# EAGLE design buslamp (EAGLE 5.11)
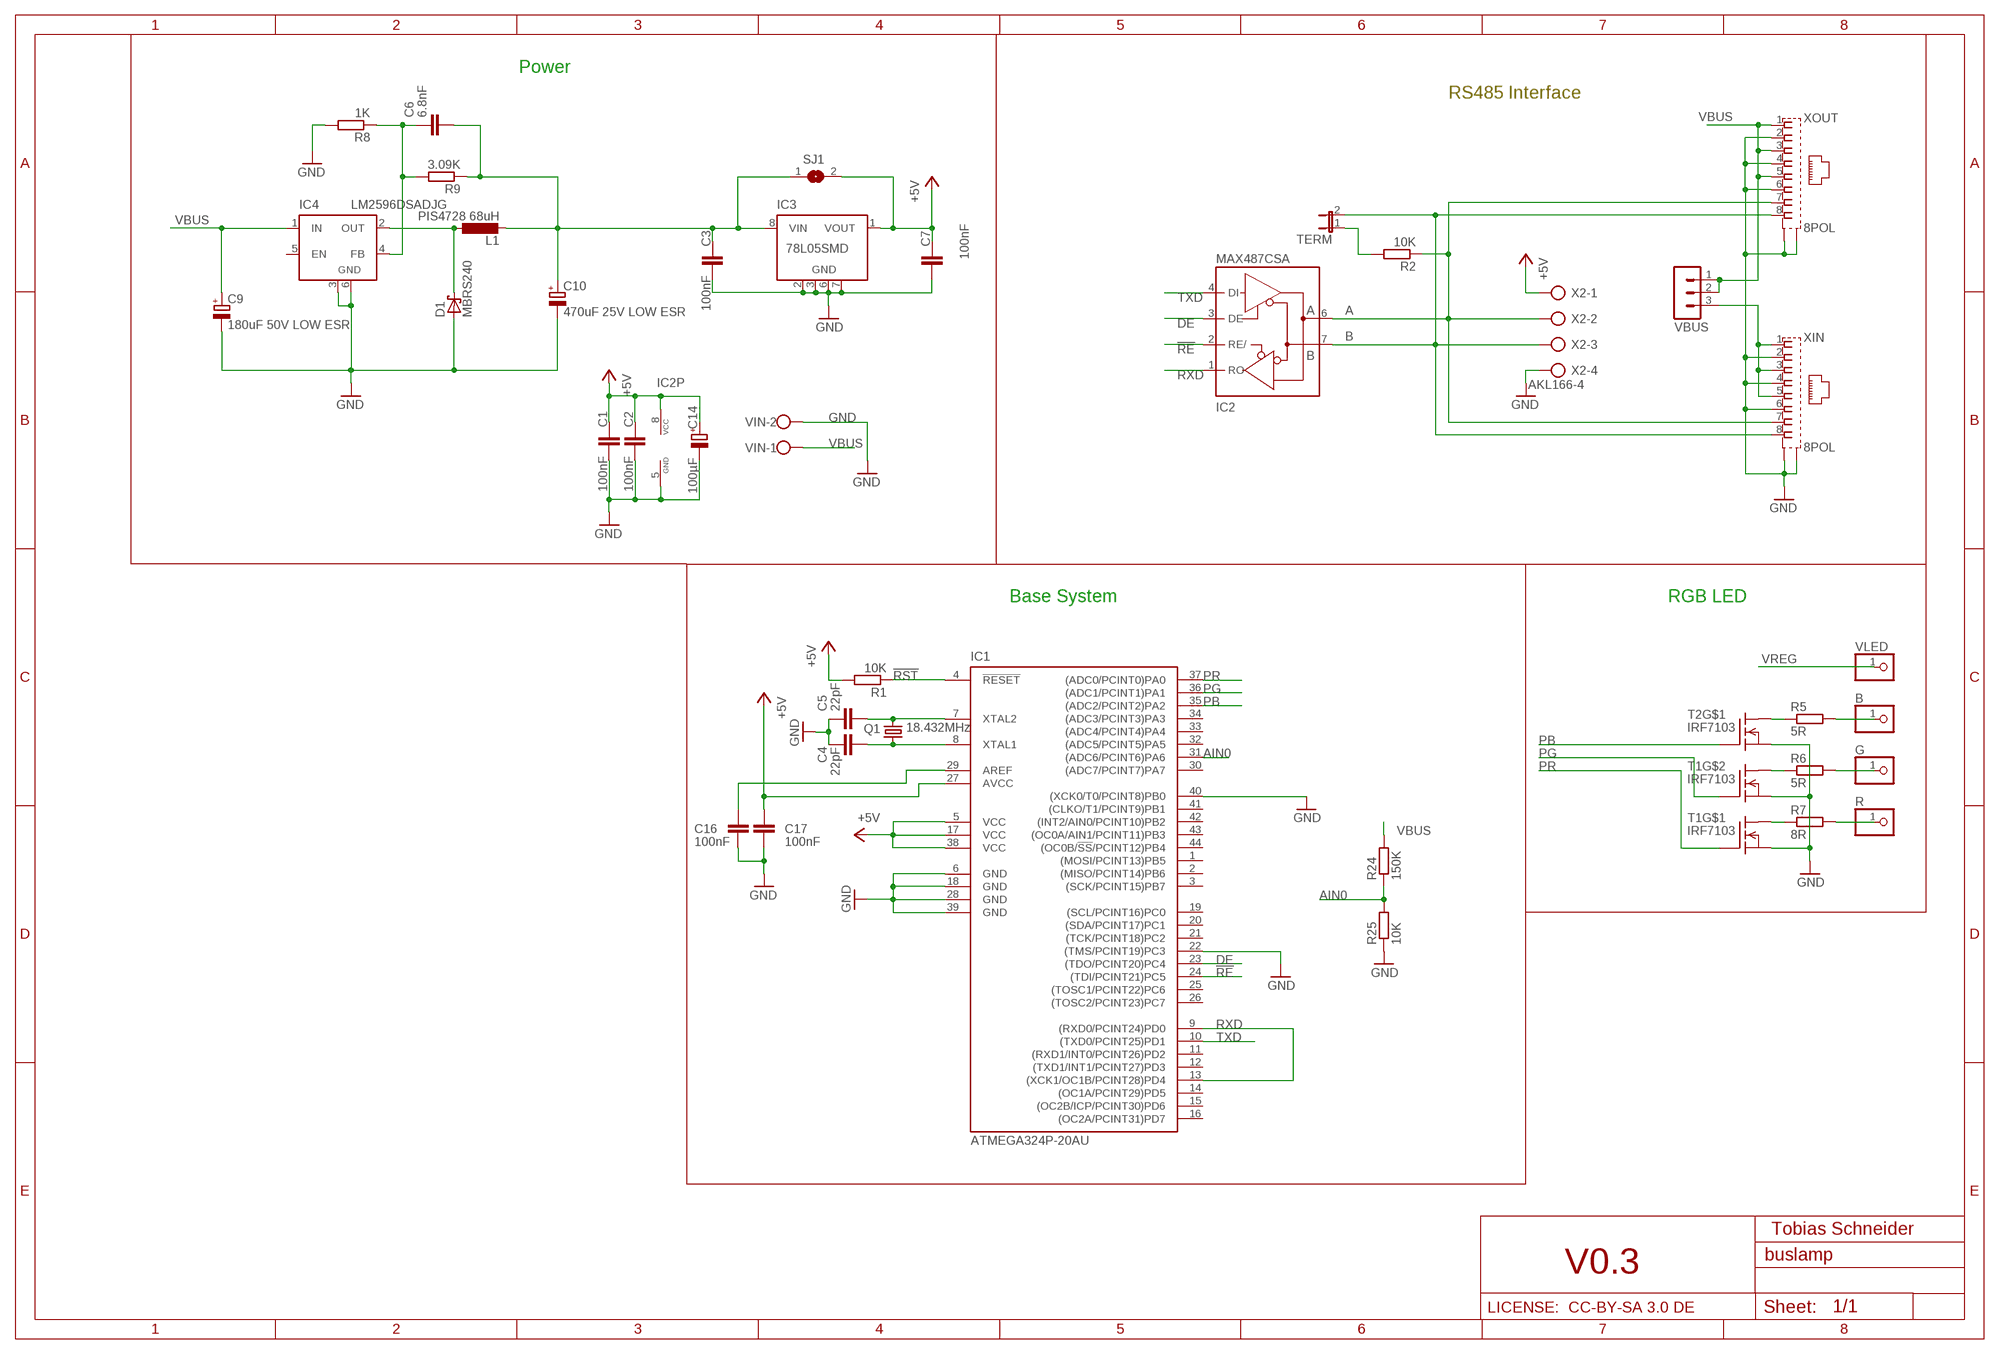
[diagram p0: schematic, sheet 1]

## Parts
B  PINHD-1X1  [1X01]
C1  100nF  C-EUC0805K  [C0805K]
C2  100nF  C-EUC0805K  [C0805K]
C3  100nF  C-EUC0805K  [C0805K]
C4  22pF  C-EUC0805K  [C0805K]
C5  22pF  C-EUC0805K  [C0805K]
C6  6.8nF  C-EUC0805K  [C0805K]
C7  100nF  C-EUC0805K  [C0805K]
C9  180uF 50V LOW ESR  CPOL-EUE3.5-8  [E3,5-8]
C10  470uF 25V LOW ESR  CPOL-EUE2.5-5  [E2,5-5]
C14  100µF  CPOL-EUE2.5-6  [E2,5-6]
C16  100nF  C-EUC0805  [C0805]
C17  100nF  C-EUC0805  [C0805]
D1  MBRS240  MBRS130LT3  [SMB]
G  PINHD-1X1  [1X01]
IC1  ATMEGA324P-20AU  MEGA164P/324P/644P-AU  [TQFP44]
IC2  MAX487CSA  MAX481CSA  [SO08]
IC3  78L05SMD  [SO08]
IC4  LM2596DSADJG  LM2596S  [TO263-5]
L1  PIS4728 68uH  PSI4728  [PIS4728]
Q1  18.432MHz  CRYTALHC49S  [HC49/S]
R  PINHD-1X1  [1X01]
R1  10K  R-EU_M0805  [M0805]
R2  10K  R-EU_M1206  [M1206]
R5  5R  R-EU_0414/15  [0414/15]
R6  5R  R-EU_0414/15  [0414/15]
R7  8R  R-EU_0414/15  [0414/15]
R8  1K  R-EU_M0805  [M0805]
R9  3.09K  R-EU_M0805  [M0805]
R24  150K  R-EU_R0805  [R0805]
R25  10K  R-EU_R0805  [R0805]
SJ1  SJ  [SJ]
T1  IRF7103  [SO-8]
T2  IRF7103  [SO-8]
TERM  JP1E  [JP1]
VBUS  MA03-1  [MA03-1]
VIN  W237-102-350  [W237-102-3.5-1.2]
VLED  PINHD-1X1  [1X01]
X2  AKL166-4  RIACON-4  [RIACON-4]
XIN  8POL  [8POL]
XOUT  8POL  [8POL]

## Nets
!RE: IC1.24((TDI/PCINT21)PC5) IC2.2(RE/)
!RST: IC1.4(!RESET) R1.1
+5V: C1.1 C2.1 C7.1 C14.+ C17.2 IC1.5(VCC) IC1.17(VCC) IC1.27(AVCC) IC1.38(VCC) IC2.8(VCC) IC3.1(VOUT) R1.2 SJ1.2 X2.1
A: IC2.6(A) R2.1 X2.2 XIN.7 XOUT.7
AIN0: IC1.31((ADC6/PCINT6)PA6) R24.1 R25.2
B: IC2.7(B) TERM.2 X2.3 XIN.8 XOUT.8
DE: IC1.23((TDO/PCINT20)PC4) IC2.3(DE)
GND: C1.2 C2.2 C3.2 C4.1 C5.1 C7.2 C9.- C10.- C14.- C16.1 C17.1 D1.A IC1.6(GND) IC1.18(GND) IC1.22((TMS/PCINT19)PC3) IC1.28(GND) IC1.39(GND) IC1.40((XCK0/T0/PCINT8)PB0) IC2.5(GND) IC3.2(GND) IC3.3(GND) IC3.6(GND) IC3.7(GND) IC4.3(GND) IC4.6(GND) R8.2 R25.1 T1.1(S) T1.3(S) T2.1(S) VIN.2 X2.4 XIN.2 XIN.4 XIN.6 XIN.S1 XIN.S2 XOUT.2 XOUT.4 XOUT.6 XOUT.S1 XOUT.S2
N$1: R7.1 T1.8(D1)
N$3: C6.1 IC4.4(FB) R8.1 R9.2
N$4: R6.1 T1.5(D1)
N$5: R5.1 T2.8(D1)
N$6: R2.2 TERM.1
N$7: R7.2 R.1
N$8: G.1 R6.2
N$9: B.1 R5.2
N$10: D1.C IC4.2(OUT) L1.1
N$29: C16.2 IC1.29(AREF)
PB: IC1.35((ADC2/PCINT2)PA2) T2.2(G)
PG: IC1.36((ADC1/PCINT1)PA1) T1.4(G)
PR: IC1.37((ADC0/PCINT0)PA0) T1.2(G)
RXD: IC1.9((RXD0/PCINT24)PD0) IC1.13((XCK1/OC1B/PCINT28)PD4) IC2.1(RO)
TXD: IC1.10((TXD0/PCINT25)PD1) IC2.4(DI)
VBUS: C9.+ IC4.1(IN) R24.2 VBUS.1 VBUS.2 VIN.1 XOUT.1 XOUT.3 XOUT.5
VBUSOUT: VBUS.3 XIN.1 XIN.3 XIN.5
VREG: C3.1 C6.2 C10.+ IC3.8(VIN) L1.2 R9.1 SJ1.1 VLED.1
XTAL1: C5.2 IC1.7(XTAL2) Q1.2
XTAL2: C4.2 IC1.8(XTAL1) Q1.1
Unconnected: IC1.1((MOSI/PCINT13)PB5) IC1.2((MISO/PCINT14)PB6) IC1.3((SCK/PCINT15)PB7) IC1.11((RXD1/INT0/PCINT26)PD2) IC1.12((TXD1/INT1/PCINT27)PD3) IC1.14((OC1A/PCINT29)PD5) IC1.15((OC2B/ICP/PCINT30)PD6) IC1.16((OC2A/PCINT31)PD7) IC1.19((SCL/PCINT16)PC0) IC1.20((SDA/PCINT17)PC1) IC1.21((TCK/PCINT18)PC2) IC1.25((TOSC1/PCINT22)PC6) IC1.26((TOSC2/PCINT23)PC7) IC1.30((ADC7/PCINT7)PA7) IC1.32((ADC5/PCINT5)PA5) IC1.33((ADC4/PCINT4)PA4) IC1.34((ADC3/PCINT3)PA3) IC1.41((CLKO/T1/PCINT9)PB1) IC1.42((INT2/AIN0/PCINT10)PB2) IC1.43((OC0A/AIN1/PCINT11)PB3) IC1.44((OC0B/!SS!/PCINT12)PB4) IC3.4(NC) IC3.5(NC) IC4.5(EN) T1.6(D) T1.7(D) T2.3(S) T2.4(G) T2.5(D1) T2.6(D) T2.7(D)

## Notes on the sheet
- Power
- RS485 Interface
- Base System | RGB LED
- Tobias Schneider
- V0.3
- LICENSE:  CC-BY-SA 3.0 DE

## Library data of the parts
B G R VLED = pinhead:PINHD-1X1: PIN HEADER
C1-C7 C16 C17 = rcl:C-EU: CAPACITOR, European symbol
C9 C10 C14 = rcl:CPOL-EU: POLARIZED CAPACITOR, European symbol
D1 = diode:MBRS130LT3: Schottky Power Rectifier Source: http://www.onsemi.com/pub/Collateral/MBRS130LT3-D.PDF
IC1 = avr-5:MEGA164P/324P/644P-AU
IC2 = maxim:MAX481CSA: RS485 TRANSEIVER
IC3 = linear:78L*SMD: Positive VOLTAGE REGULATOR
IC4 = linear:LM2596S: STEP-DOWN VOLTAGE REGULATOR
L1 = rcl:PSI4728
Q1 = crystal:CRYTAL: CRYSTAL
R1 R2 R8 R9 R24 R25 = rcl:R-EU_: RESISTOR, European symbol
R5-R7 = rclml:R-EU_: RESISTOR, European symbol
SJ1 = jumper:SJ: SMD solder JUMPER
T1 T2 = transistor-fet+irf7201:IRF7103
TERM = jumper:JP1E: JUMPER
VBUS = con-lstb:MA03-1: PIN HEADER
VIN = clamps:W237-102: WAGO SCREW CLAMP
X2 = con-riacon:RIACON-4
XIN XOUT = con-amp:8POL

## Board
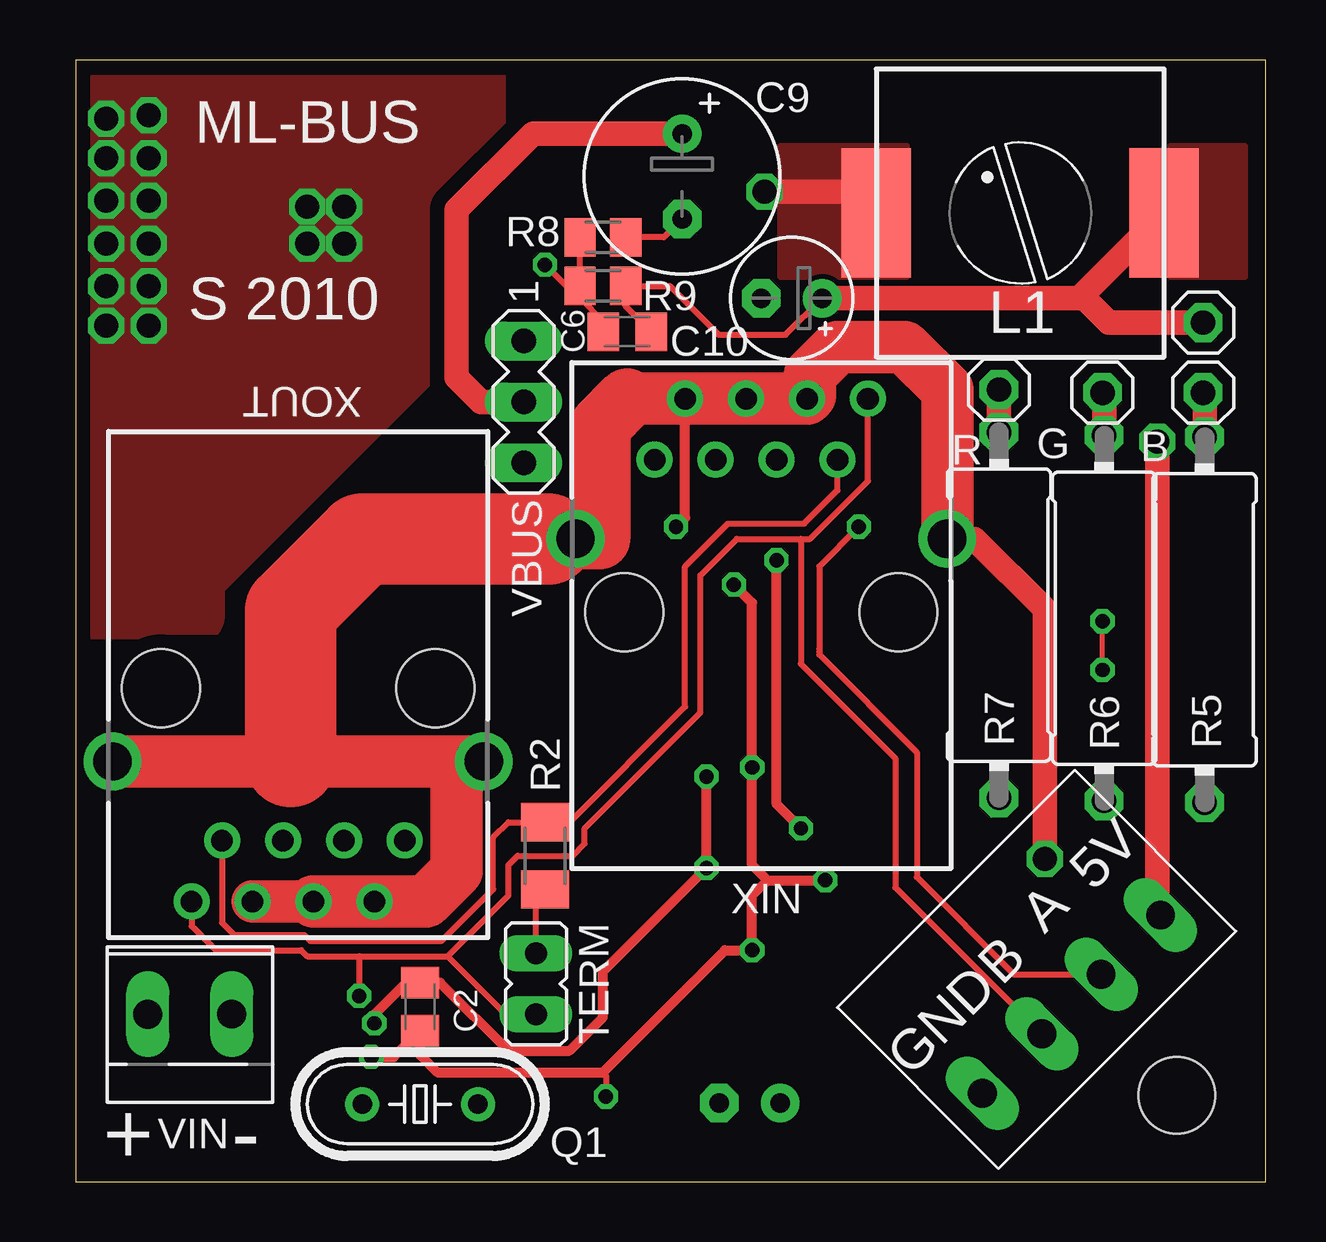
[diagram p1: board, top side]
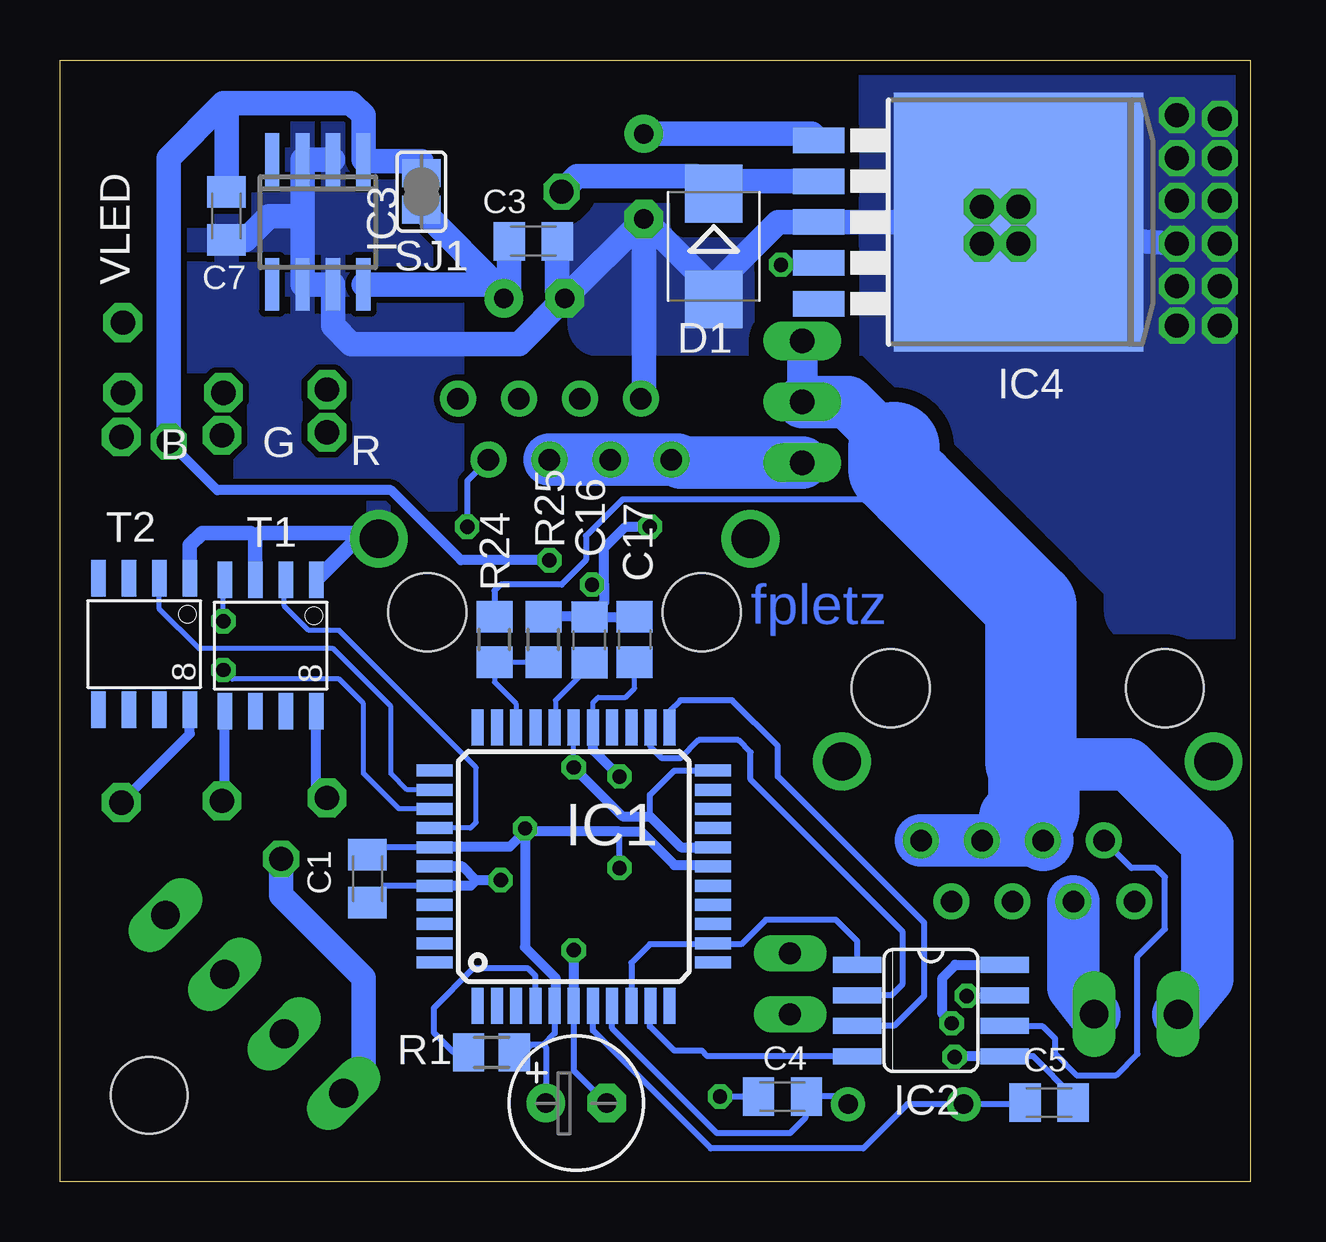
[diagram p2: board, bottom side, seen from below]

Size 49.61 x 46.76 mm. Coordinates in mm from the lower left corner, seen from the top.
Outline: 0,0 49.61,0 49.61,46.76 0,46.76 0,0
Copper layers (1*16): Top 0.035mm / dielectric 1.5mm / Bottom 0.035mm
Design rules "default *": minimum track width 0.2mm, minimum drill 0.5mm, track to track 0.2mm, track to pad 0.2mm, pad to pad 0.2mm, via to via 0.2mm, smd to smd 0mil, copper to edge 0.2mm, drill to drill 8mil, minimum pad ring 0.3mm, minimum via ring 8mil, stop-mask expansion 4mil, vias tented up to drill 0mil, thermal gap 10mil
Holes 3.2 mm at 45.89,3.61
tRestrict: area 23.7,21 to 23.7,22.4

### Footprints (pad centres in the part's own frame; a part is rotated, then mirrored left to right if it is on the bottom)
1X01 = drill 1.016 octagon: 1 0,0
C0805K = smd 1.3 x 1.6: 1 -1,0; 2 1,0
E3,5-8 = drill 0.813 pad 1.6 round: + -1.778,0 | drill 0.813 pad 1.6 octagon: - 1.778,0
E2,5-5 = drill 0.813 pad 1.6 round: + -1.27,0 | drill 0.813 pad 1.6 octagon: - 1.27,0
E2,5-6 = drill 0.813 pad 1.6 round: + -1.27,0 | drill 0.813 pad 1.6 octagon: - 1.27,0
C0805 = smd 1.3 x 1.5: 1 -0.95,0; 2 0.95,0
SMB = smd 2.4 x 2.4: A 2.2,0; C -2.2,0
TQFP44 = smd 1.5 x 0.5: 1 -5.8,4; 2 -5.8,3.2; 3 -5.8,2.4; 4 -5.8,1.6; 5 -5.8,0.8; 6 -5.8,0; 7 -5.8,-0.8; 8 -5.8,-1.6; 9 -5.8,-2.4; 10 -5.8,-3.2; 11 -5.8,-4; 23 5.8,-4; 24 5.8,-3.2; 25 5.8,-2.4; 26 5.8,-1.6; 27 5.8,-0.8; 28 5.8,0; 29 5.8,0.8; 30 5.8,1.6; 31 5.8,2.4; 32 5.8,3.2; 33 5.8,4 | smd 0.5 x 1.5: 12 -4,-5.8; 13 -3.2,-5.8; 14 -2.4,-5.8; 15 -1.6,-5.8; 16 -0.8,-5.8; 17 0,-5.8; 18 0.8,-5.8; 19 1.6,-5.8; 20 2.4,-5.8; 21 3.2,-5.8; 22 4,-5.8; 34 4,5.8; 35 3.2,5.8; 36 2.4,5.8; 37 1.6,5.8; 38 0.8,5.8; 39 0,5.8; 40 -0.8,5.8; 41 -1.6,5.8; 42 -2.4,5.8; 43 -3.2,5.8; 44 -4,5.8
SO08 = smd 0.66 x 2.032: 1 -1.905,-3.073; 2 -0.635,-3.073; 3 0.635,-3.073; 4 1.905,-3.073; 5 1.905,3.073; 6 0.635,3.073; 7 -0.635,3.073; 8 -1.905,3.073
SO08' = smd 0.6 x 2.2: 1 -1.905,-2.6; 2 -0.635,-2.6; 3 0.635,-2.6; 4 1.905,-2.6; 5 1.905,2.6; 6 0.635,2.6; 7 -0.635,2.6; 8 -1.905,2.6
TO263-5 = smd 1.067 x 2.159: 1 -3.404,-5.791; 2 -1.702,-5.791; 3 0,-5.791; 4 1.702,-5.791; 5 3.404,-5.791 | smd 10.8 x 10.41: 6 0,2.54
PIS4728 = smd 5.4 x 2.9: 1 0,6; 2 0,-6
HC49/S = drill 0.813 round: 1 -2.413,0; 2 2.413,0
M0805 = smd 1.3 x 1.6: 1 -0.95,0; 2 0.95,0
M1206 = smd 1.6 x 2: 1 -1.4,0; 2 1.4,0
0414/15 = drill 1.016 octagon: 1 -7.62,0; 2 7.62,0
R0805 = smd 1.3 x 1.5: 1 -0.95,0; 2 0.95,0
SJ = smd 1.168 x 1.6: 1 -0.762,0; 2 0.762,0
SO-8 = smd 1.524 x 0.61: 1 -2.743,1.27; 2 -2.743,0; 3 -2.743,-1.27; 4 -2.743,-2.54; 5 2.743,-2.54; 6 2.743,-1.27; 7 2.743,0; 8 2.743,1.27
JP1 = drill 0.914 long: 1 0,-1.27; 2 0,1.27
MA03-1 = drill 1.016 long: 1 -2.54,0; 2 0,0; 3 2.54,0
W237-102-3.5-1.2 = drill 1.2 long: 1 -1.7,0 | drill 1.194 long: 2 1.8,0
RIACON-4 = drill 1.2 long: 1 0,5.25; 2 0,1.75; 3 0,-1.75; 4 0,-5.25
8POL = drill 0.9 round: 1 -4.445,6.35; 2 -3.175,8.89; 3 -1.905,6.35; 4 -0.635,8.89; 5 0.635,6.35; 6 1.905,8.89; 7 3.175,6.35; 8 4.445,8.89 | drill 1.6 round: S1 -7.745,3.05; S2 7.745,3.05 | hole 3.25: -5.715,0; 5.715,0

### Placement (x,y rotation side)
B  46.99,32.89 0 top
C1  36.79,12.64 270 bottom
C2  14.35,7.3 270 top
C3  29.88,39.2 0 bottom
C4  19.49,3.56 0 bottom
C5  8.38,3.3 180 bottom
C6  22.99,35.43 0 top
C7  42.67,40.26 270 bottom
C9  25.27,41.91 270 top
C10  29.84,36.83 180 top
C14  28.09,3.28 0 bottom
C16  27.54,22.59 270 bottom
C17  25.65,22.61 270 bottom
D1  22.35,38.99 270 bottom
G  42.8,32.89 0 top
IC1  28.19,13.14 90 bottom
IC2  13.31,7.14 270 bottom
IC3  78L05SMD  [SO08']  38.86,40.01 180 bottom
IC4  12.19,40.01 270 bottom
L1  39.37,40.39 90 top
Q1  14.35,3.24 180 top
R  38.48,33.02 0 top
R1  31.62,5.4 0 bottom
R2  19.56,13.59 270 top
R5  47.05,23.43 90 top
R6  42.86,23.5 90 top
R7  38.48,23.62 90 top
R8  21.97,39.37 0 top
R9  21.97,37.34 180 top
R24  31.5,22.61 90 bottom
R25  29.46,22.61 270 bottom
SJ1  34.54,41.27 90 bottom
T1  40.2,22.35 270 bottom
T2  45.47,22.42 270 bottom
TERM  19.18,8.26 180 top
VBUS  18.67,32.51 270 top
VIN  4.7,6.99 0 top
VLED  46.99,35.81 0 top
X2  41.5,7.4 315 top
XIN  28.57,23.75 0 top
XOUT  9.27,20.57 180 top

### Tracks (layer width: path | path; a pad name or v marks a point on that pad's centre or on a via)
!RE
  Bottom 0.254: IC2.2 14.96,7.78 14.48,8.26 14.48,10.41 20.83,16.76 20.83,17.91 21.34,18.41 22.99,18.41 23.75,17.65 24.51,17.65 24.99,18.14 IC1.24 25.02,18.92
!RST
  Bottom 0.254: IC1.4 29.79,8.59 30.1,8.89 32.38,8.89 34.04,7.24 34.04,6.22 33.21,5.4 R1.1
+5V  (via drill 0.6, 1 pad 1.02)
  Top 0.254: v12.45,6.6 12.45,6.99 | 13.76,8.3 C2.1 | C2.1 14.4,8.26 | C2.1 15.19,8.3
  Top 0.406: v26.29,16.89 v26.29,13.08 21.97,8.76 21.97,6.86 20.57,5.46 18.03,5.46 15.19,8.3 | v30.23,14.73 29.21,15.75 v29.21,25.91 | 12.45,6.99 13.76,8.3
  Top 1.016: X2.1 45.09,11.25 v45.09,30.86
  Bottom 0.2: IC1.27 27.39,19.98 27.18,20.19 26.04,20.19 25.65,20.57 C17.2
  Bottom 0.254: v12.45,6.6 12.83,6.99 | 30.23,14.61 v30.23,14.73 | 33.97,13.97 IC1.38 36.48,13.94 C1.1 | 22.46,13.21 IC1.17 | 28.96,7.38 IC1.5 28.99,6.18 29.46,5.71 | v26.29,13.08 26.29,14.61 | 29.46,5.71 29.97,5.71 30.29,5.4 R1.2 30.67,5.01 | C14.+ 29.36,5.61 29.46,5.71
  Bottom 0.406: IC2.8 12.29,9.05 12.83,8.51 12.83,6.99 | 30.23,14.61 30.86,13.97 33.97,13.97 | 30.23,14.61 26.29,14.61 25.4,14.61 24,13.21 22.46,13.21 | IC1.27 27.39,18 v26.29,16.89 | 28.96,7.38 28.96,8.51 30.23,9.78 30.23,14.61 | v29.21,25.91 32.89,25.91 35.81,28.83 43.05,28.83 v45.09,30.86
  Bottom 1.016: SJ1.2 34.54,42.55 36.9,42.55 IC3.1 36.96,44.45 37.47,44.96 42.8,44.96 | v45.09,30.86 45.09,42.67 42.8,44.96 | C7.1 42.67,44.83 42.8,44.96
A  (via drill 0.6)
  Top 0.254: XIN.7 31.75,28.83 30.35,27.43 27.18,27.43 25.4,25.65 25.4,19.81 20.58,14.99 R2.1 18.03,14.99 17.4,14.35 17.4,12.19 15.24,10.03 9.78,10.03 9.53,10.29 6.6,10.29 6.1,10.79 XOUT.7 | X2.2 39.11,8.64 35.05,12.7 35.05,17.91 30.99,21.97 30.99,22.23 | 30.99,22.23 30.99,22.1 | 30.99,22.23 30.99,25.65 v32.64,27.3
  Bottom 0.254: XOUT.7 4.95,13.08 3.94,13.08 3.56,12.7 3.56,10.54 4.7,9.4 4.7,5.33 5.59,4.45 7.24,4.45 8.13,5.33 8.13,5.97 8.64,6.48 10.2,6.48 IC2.6 | v32.64,27.3 32.64,29.21 XIN.7
AIN0
  Bottom 0.2: IC1.31 30.61,18.96 30.61,19.94 31.5,20.83 R24.1 R25.2
B  (via drill 0.6)
  Top 0.254: X2.3 34.16,12.27 34.16,17.65 30.23,21.59 30.23,26.8 | XIN.8 33.02,29.21 30.61,26.8 30.23,26.8 | 30.23,26.8 27.56,26.8 26.04,25.27 26.04,19.56 21.21,14.73 21.21,14.1 20.7,13.59 18.41,13.59 18.03,13.21 18.03,11.94 15.49,9.4 | XOUT.8 4.83,10.67 5.84,9.65 9.4,9.65 9.65,9.4 11.81,9.4 | TERM.2 17.78,6.99 17.78,7.11 15.49,9.4 | 11.81,9.4 15.49,9.4 | 11.81,9.4 v11.81,7.75
  Bottom 0.254: IC2.7 11.78,7.78 v11.81,7.75
DE
  Bottom 0.2: IC1.23 24.19,19.49
  Bottom 0.254: IC2.3 14.83,6.51 13.59,7.75 13.59,10.79 19.68,16.89 19.68,18.16 21.59,20.07 23.75,20.07 24.19,19.62 IC1.23 24.26,19.01
GND  (via drill 0.6, 1)
  Top 0.254: R8.2 24.51,39.37 C9.- | v12.32,5.21 12.29,5.24 | v22.1,3.56 22.1,4.45 21.97,4.57
  Top 0.406: 28.83,12.57 28.19,13.21 v28.19,17.27 28.19,24.13 v27.43,24.89 | 28.83,12.57 v31.24,12.57 | 28.83,12.57 28.19,11.94 v28.19,9.65 27.05,9.65 21.97,4.57 15.07,4.57 14.35,5.29 C2.2 13.26,5.21 v12.32,5.21 | v25.02,27.3 25.4,27.69 XIN.2
  Top 1.016: v3.05,39.12 3.17,38.99 | v40.39,13.46 40.39,23.88 37.46,26.8 XIN.S2
  Top 1.778: XOUT.4 XOUT.6
  Top 2.184: XOUT.4 XOUT.2 14.61,11.68 15.88,12.95 15.88,17.52 | XIN.4 XIN.6 30.61,32.77 30.61,33.66 31.75,34.8 34.54,34.8 36.32,33.02 XIN.S2 | XIN.2 XIN.4 | XIN.2 22.99,32.64 | XIN.2 XIN.4 | XOUT.S2 8.96,17.52 15.88,17.52 | 15.88,17.52 XOUT.S1
  Top 2.54: 22.99,32.64 21.84,31.5 21.84,26.8 XIN.S1 19.69,26.8 19.68,26.8
  Top 3.81: 8.96,17.52 8.96,23.82 11.94,26.8 19.68,26.8
  Bottom 0.2: C16.1 27.56,23.56 | 25.67,23.54 C17.1 | v28.19,17.27 IC1.28
  Bottom 0.254: 12.29,5.24 v12.32,5.21 | 33.89,12.45 IC1.40 36.08,12.35 C1.2 | IC1.22 24,17.14 25.02,16.13 25.02,15.24 | IC2.5 9.05,5.24 7.38,3.57 C5.1 | IC1.6 28.19,4.66 C14.- | v22.1,3.56 C4.1
  Bottom 0.406: 27.56,23.56 R25.1 | 25.67,23.54 C16.1 26.92,24.16 26.92,24.89 | IC2.5 12.29,5.24 | v28.19,17.27 26.16,15.24 25.02,15.24 23.72,13.94 IC1.18 | v31.24,12.57 32.26,12.57 | v28.19,9.65 IC1.6 | 26.92,24.89 26.92,26.42 26.04,27.3 v25.02,27.3 | v27.43,24.89 26.92,24.89 | 32.26,12.57 32.49,12.35 IC1.40 | 32.26,12.57 32.83,13.14 IC1.39
  Bottom 0.61: XIN.S2 37.22,26.8 | 37.22,26.8 T1.1 | 41.47,26.86 T1.3 | 41.47,26.86 41.27,27.05 37.47,27.05 37.22,26.8 | T2.1 44.2,26.54 43.69,27.05 41.66,27.05 41.47,26.86
  Bottom 1.016: C9.- C10.- | C9.- 22.35,37.21 D1.A 22.35,37.34 19.68,40.01 IC4.3 IC4.6 7.24,39.37 v3.05,39.12 | C9.- 25.27,32.77 XIN.2 | C3.2 28.88,37.14 C10.- | IC3.2 IC3.3 39.5,40.26 | 39.5,40.26 IC3.6 IC3.7 38.23,35.69 37.47,34.92 30.48,34.92 C10.- | C7.2 41.89,39.26 40.89,40.26 39.5,40.26 | v40.39,13.46 40.39,11.94 36.96,8.51 36.96,4.53 X2.4
  Bottom 2.184: VIN.2 7.37,8.11 XOUT.6
  other vias: 1.27,44.32 3.05,42.67 1.27,42.67 1.27,39.12 1.27,37.34 3.05,35.69 3.05,44.45 9.65,40.64 11.18,40.64 11.18,39.12 3.05,37.34 1.27,40.89 3.05,40.89 1.27,35.69 9.65,39.12
  pour Bottom (isolate 0.61, no thermals): -0.76,48.01 -0.64,23.75 4.83,23.75 4.83,25.02 15.62,35.69 27.18,35.69 27.18,47.88
  pour Top (isolate 0.61, no thermals): -0.76,48.01 -0.76,23.88 -0.64,23.75 4.83,23.75 4.95,23.62 4.95,25.15 15.62,35.81 17.53,35.81 17.53,48.01
  pour Bottom (isolate 0.254): 33.4,45.21 33.27,45.21 33.27,28.45 47.88,28.45 47.88,45.47
N$1
  Bottom 0.406: T1.8 38.92,16.45 R7.1
N$3  (via drill 0.6)
  Top 0.254: 21.02,39.5 R8.1 R9.2 21.02,36.83 | v19.56,38.23 20.95,36.83 21.02,36.83 | 21.02,36.83 21.99,35.86 C6.1
  Bottom 0.254: IC4.4 18.06,38.23 v19.56,38.23
N$4
  Bottom 0.406: T1.5 42.74,16 R6.1
N$5
  Bottom 0.406: T2.8 44.2,18.67 R5.1
N$6
  Top 0.254: R2.2 19.18,11.81 TERM.1
N$7
  Top 1.016: R7.2 R.1
N$8
  Top 1.016: R6.2 42.86,32.83 G.1
N$9
  Top 1.016: R5.2 47.05,32.7 B.1
N$10  (via drill 1)
  Top 1.016: v28.7,41.27 32.1,41.27 L1.1
  Bottom 1.016: D1.C 22.23,41.07 | D1.C 23.07,41.91 28.07,41.91 v28.7,41.27 | IC4.2 21.83,41.71 D1.C
  pour Top (no thermals): 29.34,43.18 29.34,37.72 34.67,37.72 34.67,43.18
N$29
  Bottom 0.2: C16.2 27.54,21.48 28.96,20.07 28.96,18.98 IC1.29
PB
  Bottom 0.2: IC1.35 35.14,16.34 35.81,17.02 35.81,19.81 38.23,22.23 43.81,22.23 45.47,23.88 T2.2
PG  (via drill 0.6)
  Top 0.2: v42.8,21.34 v42.8,23.37
  Bottom 0.2: IC1.36 35.48,15.54 36.96,17.02 36.96,19.94 37.97,20.95 42.42,20.95 v42.8,21.34 | v42.8,23.37 42.8,25.03 T1.4
PR
  Bottom 0.2: IC1.37 32.5,14.74 32.26,14.99 32.26,17.27 37.97,22.99 39.24,22.99 40.26,24 40.26,25.03 T1.2
RXD
  Bottom 0.254: IC1.9 25.79,9.13 25.02,9.91 22.43,9.91 IC1.13 22.36,9.91 21.21,9.91 20.19,10.92 17.27,10.92 16.38,10.03 IC2.1
TXD
  Bottom 0.254: IC1.10 25.02,7.32 25.02,6.48 24,5.46 22.86,5.46 22.64,5.24 IC2.4
VBUS
  Top 1.016: VBUS.2 16.89,32.51 15.88,33.53 15.88,40.51 19.05,43.69 C9.+
  Bottom 0.254: R24.2 31.5,24.64 31.24,24.89 28.7,24.89 27.69,25.91 27.69,26.92 26.16,28.45 14.61,28.45 14.1,28.96
  Bottom 1.016: C9.+ 18.26,43.69 IC4.1
  Bottom 1.27: VBUS.1 VBUS.2
  Bottom 2.184: XOUT.1 XOUT.3 10.03,14.22 | 10.03,14.22 XOUT.5 | 9.02,15.49 10.03,14.48 10.03,14.22 | VIN.1 1.78,8.46 1.78,14.1 5.08,17.4 9.02,17.4 | 14.86,30.61 16.76,32.51 VBUS.2
  Bottom 2.54: 10.03,15.24 9.65,15.24 XOUT.5
  Bottom 3.81: 9.02,15.49 9.02,17.4 9.14,17.53 9.14,24 14.1,28.96 14.86,29.72 14.86,30.61
VBUSOUT
  Bottom 2.184: VBUS.3 23.75,29.97 23.88,30.1 XIN.1 XIN.3 XIN.5
VREG
  Top 0.254: R9.1 24.77,37.34 26.8,35.31 29.59,35.31 C10.+ | R9.1 22.97,37.29 | C6.2 22.92,36.5 R9.1
  Top 1.016: C10.+ 41.81,36.83 41.92,36.94 | 41.92,36.94 L1.2 | VLED.1 43.05,35.81 41.92,36.94
  Bottom 1.016: C3.1 30.88,37.06 C10.+ | C10.+ 31.11,37.08 SJ1.1 | IC3.8 31.69,37.41 C10.+
  pour Top (no thermals): 45.59,43.18 45.59,37.72 48.77,37.72 48.77,43.18
XTAL1
  Bottom 0.254: IC1.7 27.39,6.31 22.48,1.4 16.13,1.4 14.29,3.24 Q1.2 9.45,3.24 C5.2
XTAL2
  Bottom 0.254: IC1.8 26.59,6.4 22.23,2.03 19.18,2.03 18.54,2.67 18.54,3.51 C4.2 17.08,3.56 Q1.1

### Text on the board
Bottom: fpletz
tPlace: ML-BUS | S 2010 | 5V | A | B | GND | + | -
bPlace: R | G | B